# EAGLE design OR (EAGLE 7.4.0)
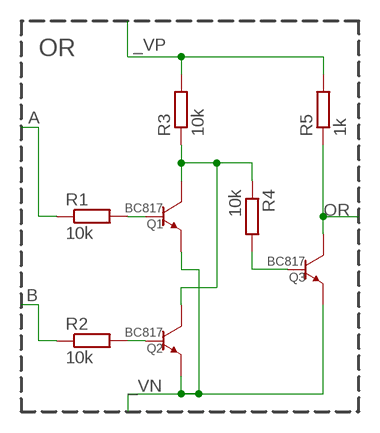
[diagram p0: schematic, sheet 1]

## Parts
Q1  BC817  TRANSISTOR-NPN-GENERICDEFAULT-SOT23-BEC  [SOT23]
Q2  BC817  TRANSISTOR-NPN-GENERICDEFAULT-SOT23-BEC  [SOT23]
Q3  BC817  TRANSISTOR-NPN-GENERICDEFAULT-SOT23-BEC  [SOT23]
R1  10k  R-EU_R0603  [R0603]
R2  10k  R-EU_R0603  [R0603]
R3  10k  R-EU_R0603  [R0603]
R4  10k  R-EU_R0603  [R0603]
R5  1k  R-EU_R0603  [R0603]

## Nets
_VN: Q1.P$2(EMITTER) Q2.P$2(EMITTER) Q3.P$2(EMITTER)
_VP: R3.2 R5.2
A: R1.1
B: R2.1
N$7: Q1.P$1(BASE) R1.2
N$9: Q2.P$1(BASE) R2.2
N$10: Q3.P$1(BASE) R4.2
N$11: Q1.P$3(COLLECTOR) Q2.P$3(COLLECTOR) R3.1 R4.1
OR: Q3.P$3(COLLECTOR) R5.1

## Notes on the sheet
- OR

## Library data of the parts
Q1-Q3 = p.peter-gator:TRANSISTOR-NPN-GENERIC; SV_SPICE_MODEL: NPN (); SV_SPICE_ORDER: COLLECTOR;BASE;EMITTER; SV_SPICE_PREFIX: Q
R1-R5 = p.peter-gator:R-EU_: RESISTOR, European symbol; SV_SPICE_ORDER: 1;2; SV_SPICE_PREFIX: R

## Board
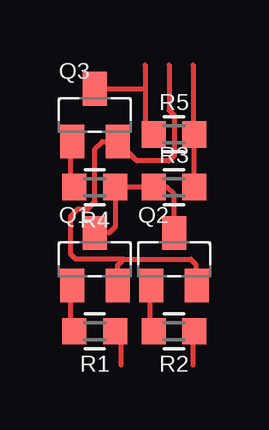
[diagram p1: board, top side]
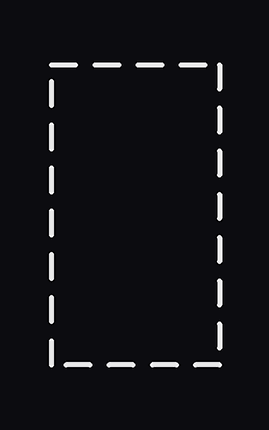
[diagram p2: board, bottom side, seen from below]

No outline drawn. Coordinates in mm, seen from the top.
Copper layers (1*16): Top 0.035mm / dielectric 1.5mm / Bottom 0.035mm
Design rules "Fusion_eagle_rule_v1.1 *": minimum track width 6mil, minimum drill 12mil, track to track 6mil, track to pad 6mil, pad to pad 6mil, via to via 6mil, smd to smd 0mil, copper to edge 10mil, drill to drill 10mil, minimum pad ring 15mil, minimum via ring 6mil, stop-mask expansion 2mil, vias tented up to drill 100mil, thermal gap 10mil

### Footprints (pad centres in the part's own frame; a part is rotated, then mirrored left to right if it is on the bottom)
SOT23 = smd 1 x 1.4: P$1 -0.95,-1.1; P$2 0.95,-1.1; P$3 0,1.1
R0603 = smd 1 x 1.1: 1 -0.85,0; 2 0.85,0

### Placement (x,y rotation side)
Q1  1.9,4.4 0 top
Q2  5.2,4.4 0 top
Q3  1.9,10.4 0 top
R1  1.9,1.4 180 top
R2  5.2,1.4 180 top
R3  5.2,7.4 0 top
R4  1.9,7.4 180 top
R5  5.2,9.6 0 top

### Tracks (layer width: path | path; a pad name or v marks a point on that pad's centre or on a via)
_VN
  Top 0.2: Q1.P$2 2.85,4.15 3.1,4.4 | 3.1,4.4 5.9,4.4 6.1,4.2 6.1,3.35 Q2.P$2 | 5,12.5 5,10.6 5.2,10.4 5.2,8.7 5,8.5 3.65,8.5 Q3.P$2 2.2,9.3 1.9,9 1.9,6.8 1.6,6.5 1.2,6.5 0.9,6.2 0.9,4.6 1.1,4.4 3.1,4.4
_VP
  Top 0.2: R3.2 R5.2 6,9.55 6,12.5
A
  Top 0.2: 3,0 3,1.3 2.9,1.35 R1.1
B
  Top 0.2: 6,0 6,1.45 R2.1
N$7
  Top 0.2: R1.2 1,1.4 0.9,1.5 0.9,3.25 Q1.P$1
N$9
  Top 0.2: R2.2 4.2,1.4 4.2,3.25 Q2.P$1
N$10
  Top 0.2: R4.2 0.9,7.4 0.9,9.25 Q3.P$1
N$11
  Top 0.2: Q2.P$3 5.2,7.1 4.9,7.4 R3.1 R4.1 2.75,5.75 2.5,5.5 Q1.P$3
OR
  Top 0.2: Q3.P$3 4,11.5 | 4,12.5 4,11.5 | 4,11.5 4,9.95 R5.1